# Altium schematic sheet AMP02.SchDoc
size A4
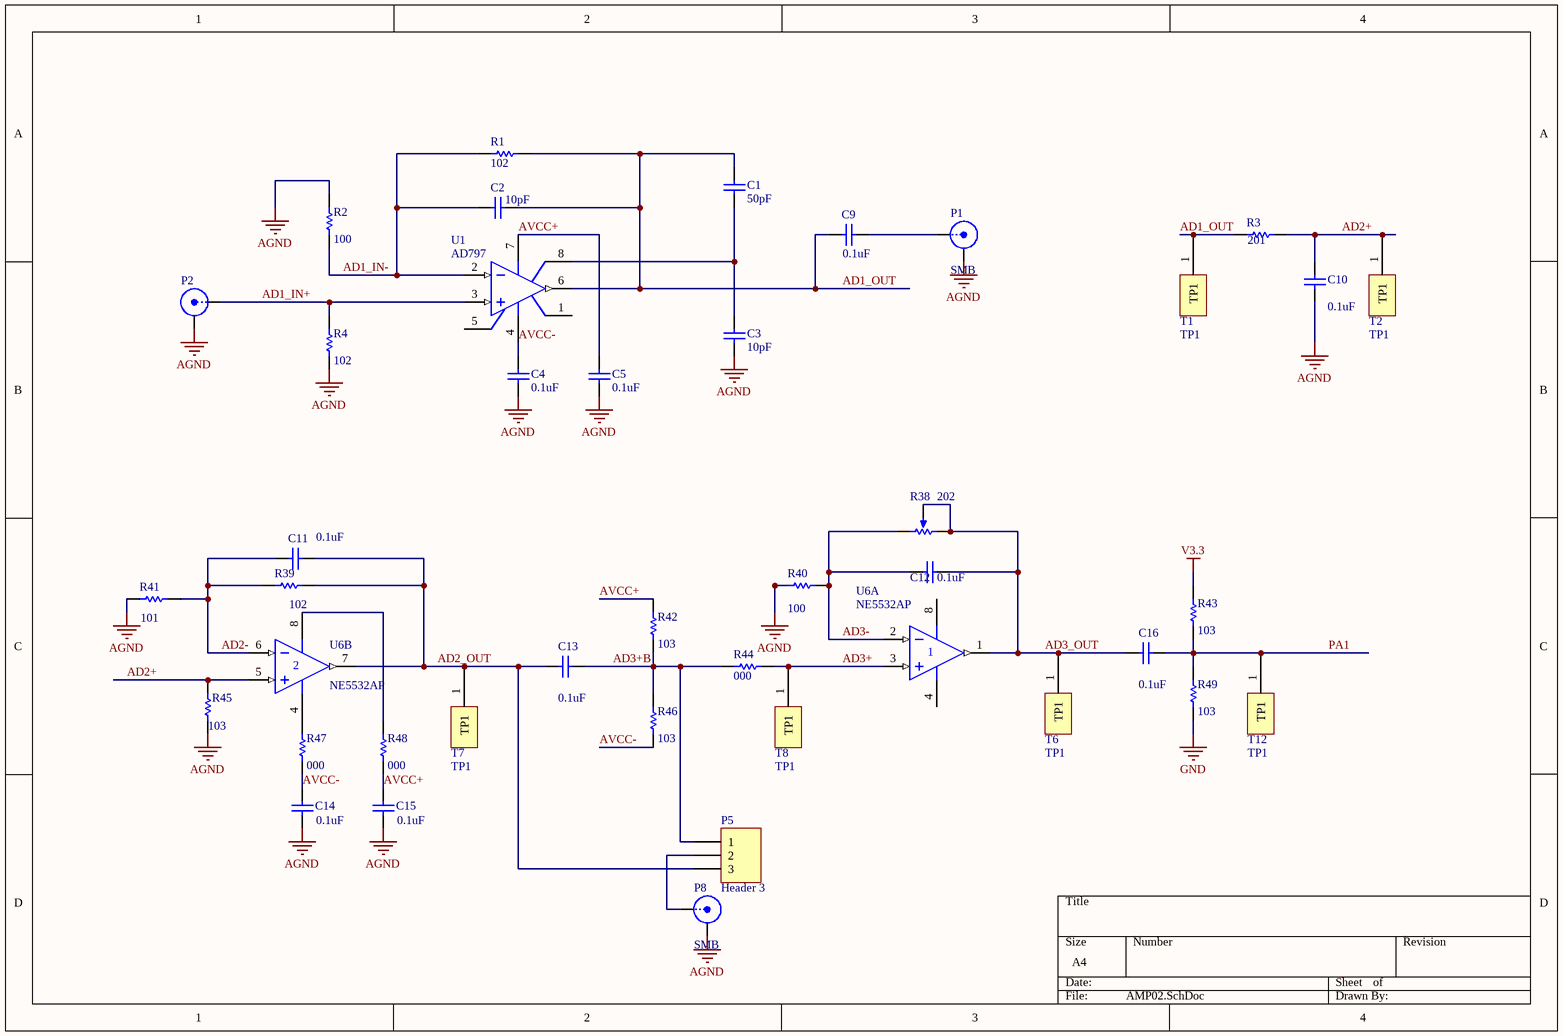
[diagram p0: AMP02.SchDoc]

## Parts
C1  value 50pF  [1206]  (hidden comment: Cap Semi)
C2  value 10pF  [1206]  (hidden comment: Cap Semi)
C3  value 10pF  [1206]  (hidden comment: Cap Semi)
C4  value 0.1uF  [1206]  (hidden comment: Cap Semi)
C5  value 0.1uF  [1206]  (hidden comment: Cap Semi)
C9  value 0.1uF  [1206]  (hidden comment: Cap Semi)
C10  value 0.1uF  [1206]  (hidden comment: Cap Semi)
C11  value 0.1uF  [1206]  (hidden comment: Cap Semi)
C12  value 0.1uF  [1206]  (hidden comment: Cap Semi)
C13  value 0.1uF  [1206]  (hidden comment: Cap Semi)
C14  value 0.1uF  [1206]  (hidden comment: Cap Semi)
C15  value 0.1uF  [1206]  (hidden comment: Cap Semi)
C16  value 0.1uF  [1206]  (hidden comment: Cap Semi)
P1  SMB  [SMB_V-RJ45]
P2  SMB  [SMB_V-RJ45]  (value not drawn)
P5  Header 3  [HDR1X3]
P8  SMB  [SMB_V-RJ45]
R1  value 102  [1206]  (hidden comment: Res Semi)
R2  value 100  [1206]  (hidden comment: Res Semi)
R3  value 201  [1206]  (hidden comment: Res Semi)
R4  value 102  [1206]  (hidden comment: Res Semi)
R38  value 202  [VR5]  (hidden comment: RPot)
R39  value 102  [1206]  (hidden comment: Res Semi)
R40  value 100  [1206]  (hidden comment: Res Semi)
R41  value 101  [1206]  (hidden comment: Res Semi)
R42  value 103  [1206]  (hidden comment: Res Semi)
R43  value 103  [1206]  (hidden comment: Res Semi)
R44  value 000  [1206]  (hidden comment: Res Semi)
R45  value 103  [1206]  (hidden comment: Res Semi)
R46  value 103  [1206]  (hidden comment: Res Semi)
R47  value 000  [1206]  (hidden comment: Res Semi)
R48  value 000  [1206]  (hidden comment: Res Semi)
R49  value 103  [1206]  (hidden comment: Res Semi)
T1  TP1  [TP1]
T2  TP1  [TP1]
T6  TP1  [TP1]
T7  TP1  [TP1]
T8  TP1  [TP1]
T12  TP1  [TP1]
U1  AD797  [SO-8C_M]
U6  NE5532AP  [SO-8C_M]  (parts A,B of 2)

## Nets
AGND: C3.1 C4.1 C5.1 C10.1 C14.1 C15.1 P1.2(Y) P2.2(Y) P8.2(Y) R2.2 R4.1 R40.1 R41.1 R45.1
GND: R49.1
V3.3: R43.2
AD1_IN+: P2.1(X) R4.2 U1.3(IN+)
AD1_IN-: C2.1 R1.2 R2.1 U1.2(IN-)
AD1_OUT: C1.2 C2.2 C9.1 R1.1 R3.1 T1.1(TP1) U1.6(OUT)
AD2+: C10.2 R3.2 R45.2 T2.1(TP1) U6.5(IN+)
AD2-: C11.1 R39.1 R41.2 U6.6(IN-)
AD2_OUT: C11.2 C13.1 P5.3 R39.2 T7.1(TP1) U6.7(OUT)
AD3+: R44.1 T8.1(TP1) U6.3(IN+)
AD3+B: C13.2 P5.1 R42.1 R44.2 R46.2
AD3-: C12.1 R38.2(BOT) R40.2 U6.2(IN-)
AD3_OUT: C12.2 C16.1 R38.1(TOP) R38.3(TAP) T6.1(TP1) U6.1(OUT)
AVCC+: C5.2 C15.2 R42.2 R48.1 U1.7(V+)
AVCC-: C4.2 C14.2 R46.1 R47.1 U1.4(V-)
PA1: C16.2 R43.1 R49.2 T12.1(TP1)
NetC1_1: C1.1 C3.2 U1.8(DECMPEN)
NetC9_2: C9.2 P1.1(X)
NetP5_2: P5.2 P8.1(X)
NetR47_2: R47.2 U6.4(V-)
NetR48_2: R48.2 U6.8(V+)

Not connected (* = marked no-connect by the designer): U1 1(OS_NUL) 5(OS_NUL)

## Library data of the parts
C1-C5 C9-C16 = Cap Semi: Capacitor (Semiconductor SIM Model); Published: 8-Jun-2000; LatestRevisionDate: 29-May-2009; LatestRevisionNote: IPC-7351 Footprint Added.; PackageReference: C1206; Publisher: Altium Limited; PackageDescription: Chip Capacitor
P1 P2 P8 = SMB: SMB Straight Connector; LatestRevisionDate: 17-Jul-2002; LatestRevisionNote: Re-released for DXP Platform.; Publisher: Altium Limited
P5 = Header 3: Header, 3-Pin; LatestRevisionDate: 17-Jul-2002; LatestRevisionNote: Re-released for DXP Platform.; Publisher: Altium Limited
R1-R4 R39-R49 = Res Semi: Semiconductor Resistor; Published: 8-Jun-2000; LatestRevisionDate: 17-Jul-2002; LatestRevisionNote: Re-released for DXP Platform.; PackageReference: AXIAL-0.5; Publisher: Altium Limited
R38 = RPot: Potentiometer; Sim Note: Enter the Resistance value and the set point into parameter fields.; Set Position: 0.5; Published: 8-Jun-2000; LatestRevisionDate: 17-Jul-2002; LatestRevisionNote: Re-released for DXP Platform.; PackageReference: VR5; Publisher: Altium Limited
U1 = AD797AR: Ultra-Low Distortion, Ultra-Low Noise Operational Amplifier; Published: 8-Jun-2000; LatestRevisionDate: 13-Apr-2006; LatestRevisionNote: IPC-7351 Footprint Added.; DatasheetVersion: REV. C; PackageVersion: revC; PackageReference: SO-8C; Publisher: Altium Limited; PackageDescription: 8-Pin Small Outline Integrated Circuit 1.27 mm Pitch; Code_IPC: SOIC127P600-8; ComponentLink1Description: Manufacturer Link; ComponentLink1URL: http://www.analog.com/en/prod/0,,759_786_AD797%2C00.html; ComponentLink2Description: Datasheet; ComponentLink2URL: http://www.analog.com/UploadedFiles/Data_Sheets/507345751AD797_d.pdf
U6 = NE5532AP: Dual Low-Noise Operational Amplifier; Published: 15-Apr-2002; LatestRevisionDate: 04-Mar-2005; LatestRevisionNote: Stylized 3D Model Added.; DatasheetVersion: May-1988; PackageVersion: Jun-1999; PackageReference: P008; Publisher: Altium Limited; PackageDescription: DIP; 8 Leads; Row Spacing 7.62 mm; Pitch 2.54 mm; Code_JEDEC: MO-001-AN; ComponentLink1Description: Manufacturer Link; ComponentLink1URL: http://www.ti.com/; ComponentLink2Description: Datasheet; ComponentLink2URL: http://www-s.ti.com/sc/ds/ne5532a.pdf